# Altium schematic sheet EMG V2.SchDoc
size A4
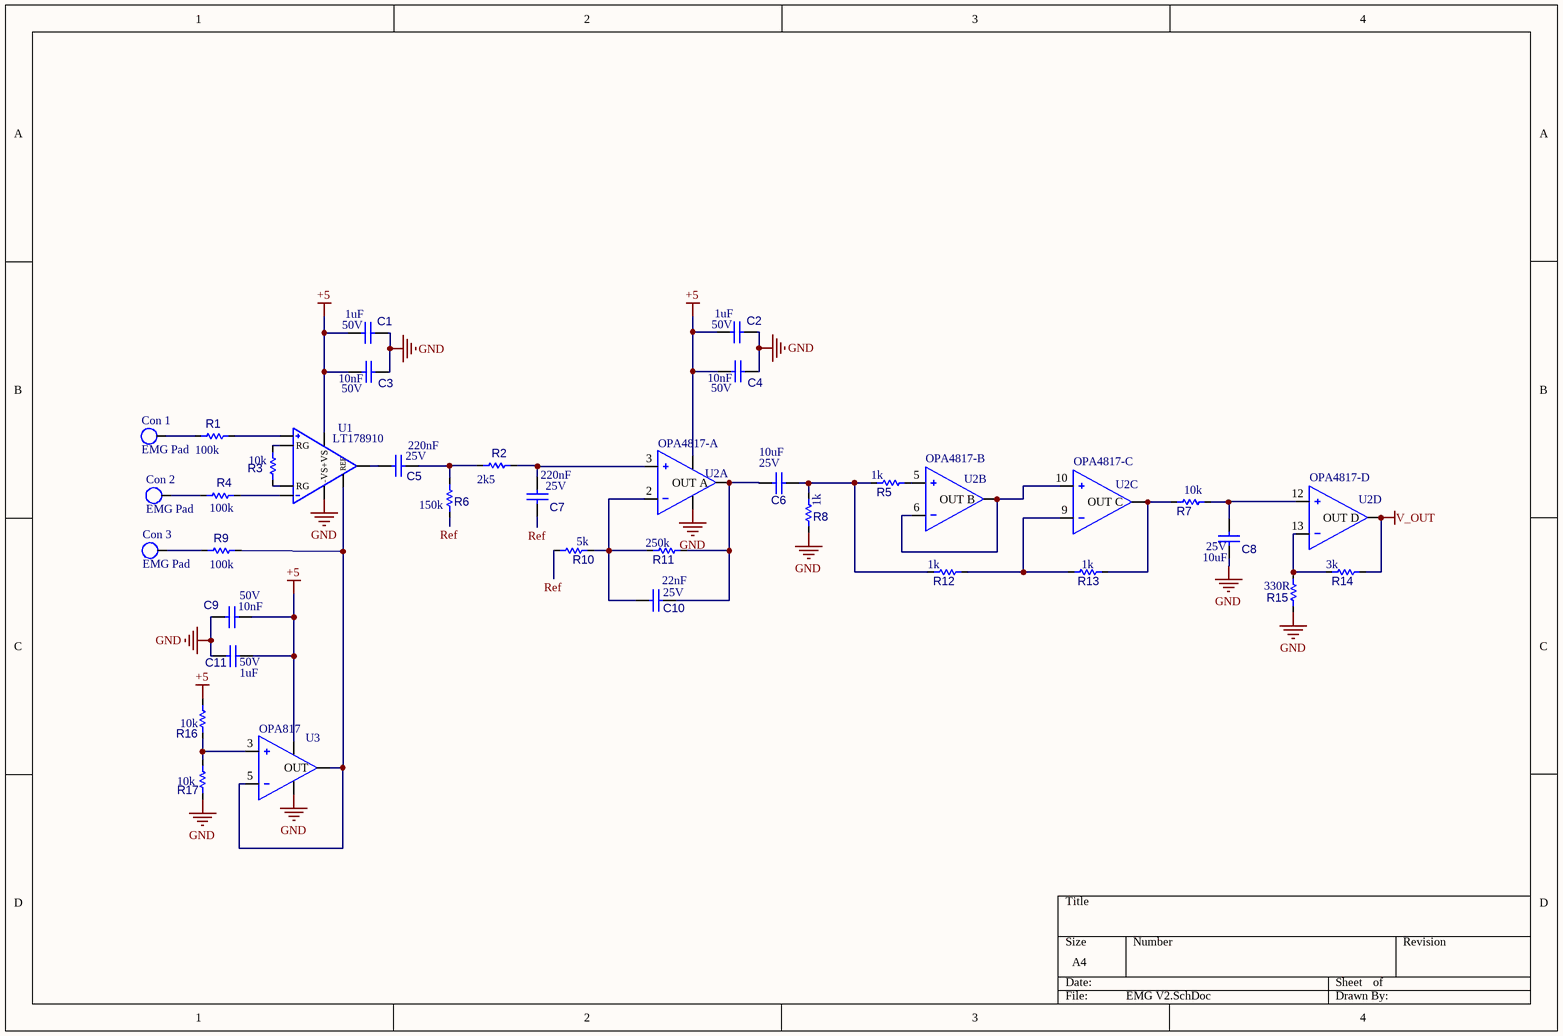
[diagram p0: EMG V2.SchDoc]

## Parts
C1  value 1uF  Voltage: 50V  [0603 Capacitor]  (hidden comment: 1uF/50V)
C2  value 1uF  Voltage: 50V  [0603 Capacitor]  (hidden comment: 1uF/50V)
C3  value 10nF  Voltage: 50V  [0603 Capacitor]  (hidden comment: 10nF/50V)
C4  value 10nF  Voltage: 50V  [0603 Capacitor]  (hidden comment: 10nF/50V)
C5  value 220nF  Voltage: 25V  [0603 Capacitor]  (hidden comment: 220nF/25V)
C6  value 10uF  Voltage: 25V  [0603 Capacitor]  (hidden comment: 10uF/25V)
C7  value 220nF  Voltage: 25V  [0603 Capacitor]  (hidden comment: 220nF/25V)
C8  value 10uF  Voltage: 25V  [0603 Capacitor]  (hidden comment: 10uF/25V)
C9  value 10nF  Voltage: 50V  [0603 Capacitor]  (hidden comment: 10nF/50V)
C10  value 22nF  Voltage: 25V  [0603 Capacitor]  (hidden comment: 22nF/25V)
C11  value 1uF  Voltage: 50V  [0603 Capacitor]  (hidden comment: 1uF/50V)
Con_1  EMG Pad  [PCBComponent_1]
Con_2  EMG Pad  [PCBComponent_1]
Con_3  EMG Pad  [PCBComponent_1]
R1  100k  [0603 Resistor]
R2  2k5  [0603 Resistor]
R3  10k  [0603 Resistor]
R4  100k  [0603 Resistor]
R5  1k  [0603 Resistor]
R6  150k  [0603 Resistor]
R7  10k  [0603 Resistor]
R8  1k  [0603 Resistor]
R9  100k  [0603 Resistor]
R10  5k  [0603 Resistor]
R11  250k  [0603 Resistor]
R12  1k  [0603 Resistor]
R13  1k  [0603 Resistor]
R14  3k  [0603 Resistor]
R15  330R  [0603 Resistor]
R16  10k  [0603 Resistor]
R17  10k  [0603 Resistor]
U1  LT178910  [SOIC 8 LT178910]
U2  OPA4817  [TSSOP14 OPA4187]  (value not drawn)  (parts A,B,C,D of 4)
U3  OPA187  [SOT23-5]  (value not drawn)

## Nets
+5: C1.1 C2.1 C3.1 C4.1 C9.1 C11.1 R16.1 U1.7(+VS) U2.4(V+) U3.4(V+)
GND: C1.2 C2.2 C3.2 C4.2 C8.2 C9.2 C11.2 R8.2 R15.2 R17.2 U1.4(-VS) U2.11(V-) U3.2(V-)
V_OUT: R14.2 U2.14(OUT_D)
Ref: C7.2 R6.2 R10.1
NetC5_1: C5.1 U1.6(OUT)
NetC5_2: C5.2 R2.1 R6.1
NetC6_1: C6.1 C10.2 R11.2 U2.1(OUT_A)
NetC6_2: C6.2 R5.1 R8.1 R12.1
NetC7_1: C7.1 R2.2 U2.3(+IN_A)
NetC8_1: C8.1 R7.2 U2.12(+IN_C)
NetC10_1: C10.1 R10.2 R11.1 U2.2(-IN_A)
NetCon_1_1: Con_1.1 R1.1
NetCon_2_1: Con_2.1 R4.1
NetCon_3_1: Con_3.1 R9.1
NetR1_2: R1.2 U1.3(+IN)
NetR3_1: R3.1 U1.1(RG)
NetR3_2: R3.2 U1.8(RG)
NetR4_2: R4.2 U1.2(-IN)
NetR5_2: R5.2 U2.5(+IN_B)
NetR7_1: R7.1 R13.2 U2.8(OUT_C)
NetR9_2: R9.2 U1.5(REF) U3.1(OUT) U3.5(-IN)
NetR12_2: R12.2 R13.1 U2.9(-IN_C)
NetR14_1: R14.1 R15.1 U2.13(-IN_C)
NetR16_2: R16.2 R17.1 U3.3(+IN)
NetU2_6: U2.6(-IN_B) U2.7(OUT_B) U2.10(+IN_C)

## Notes on the sheet
- (in symbol OPA187-2) OPA817
- (in symbol OPA4817-2, part A) OPA4817-A
- (in symbol OPA4817-2, part B) OPA4817-B
- (in symbol OPA4817-2, part C) OPA4817-C
- (in symbol OPA4817-2, part D) OPA4817-D

## Library data of the parts
C1 C2 C11 = 1uF/50V: Manufacturer: Any; Tolerance: 20%; Capacitor Type: Ceramic; Dielectryc: X7R; Temperature: -55ºC TO +125ºC; Mount Type: SMD; Manufacturer PN: Any; Package: 0603
C3 C4 C9 = 10nF/50V: Manufacturer: Any; Tolerance: 20%; Capacitor Type: Ceramic; Dielectryc: X7R; Temperature: -55ºC TO +125ºC; Mount Type: SMD; Manufacturer PN: Any; Package: 0603
C5 C7 = 220nF/25V: Manufacturer: Any; Tolerance: 20%; Capacitor Type: Ceramic; Dielectryc: X7R; Temperature: -55ºC TO +125ºC; Mount Type: SMD; Manufacturer PN: Any; Package: 0603
C6 C8 = 10uF/25V: Manufacturer: Any; Tolerance: 20%; Capacitor Type: Ceramic; Dielectryc: X7R; Temperature: -55ºC TO +125ºC; Mount Type: SMD; Manufacturer PN: Any; Package: 0603
C10 = 22nF/25V: Manufacturer: Any; Tolerance: 20%; Capacitor Type: Ceramic; Dielectryc: X7R; Temperature: -55ºC TO +125ºC; Mount Type: SMD; Manufacturer PN: Any; Package: 0603
Con_1-Con_3 = Pad
R1 R4 R9 = 100k: Manufacturer: Any; Tolerance: 10%; Power Dissipation: 1/10 W; Temperature: -55°C to 155°C; Mount Type: SMD; Manufacturer PN: Any; Package: 0603; 150k: 100k
R2 = 2k5: Manufacturer: Any; Tolerance: 10%; Power Dissipation: 1/10 W; Temperature: -55°C to 155°C; Mount Type: SMD; Manufacturer PN: Any; Package: 0603; Value: 2k5
R3 R7 R16 R17 = 10k: Manufacturer: Any; Tolerance: 10%; Power Dissipation: 1/10 W; Temperature: -55ºC TO 155ºC; Mount Type: SMD; Manufacturer PN: Any; Package: 0603; Value: 10k
R5 R8 R12 R13 = 1k: Manufacturer: Any; Tolerance: 10%; Power Dissipation: 1/10 W; Temperature: -55ºC TO 155ºC; Mount Type: SMD; Manufacturer PN: Any; Package: 0603; Value: 1k
R6 = 150k: Manufacturer: Any; Tolerance: 10%; Power Dissipation: 1/10 W; Temperature: -55°C to 155°C; Mount Type: SMD; Manufacturer PN: Any; Package: 0603; 150k: 150k
R10 = 5k: Manufacturer: Any; Tolerance: 10%; Power Dissipation: 1/10 W; Temperature: -55ºC TO 155ºC; Mount Type: SMD; Manufacturer PN: Any; Package: 0603; Value: 5k
R11 = 250k: Manufacturer: Any; Tolerance: 10%; Power Dissipation: 1/10 W; Temperature: -55ºC TO 155ºC; Mount Type: SMD; Manufacturer PN: Any; Package: 0603; Value: 250k
R14 = 3k: Manufacturer: Any; Tolerance: 10%; Power Dissipation: 1/10 W; Temperature: -55ºC TO 155ºC; Mount Type: SMD; Manufacturer PN: Any; Package: 0603; Value: 3k
R15 = 330R: Manufacturer: Any; Tolerance: 10%; Power Dissipation: 1/10 W; Temperature: -55ºC TO 155ºC; Mount Type: SMD; Manufacturer PN: Any; Package: 0603; Value: 330R
U1 = LT178910-2: Micropower, Single Supply Rail-to-Rail, Output Instrumentation Amplifiers; Manufacturer: Linear Technologiy; IC Type: INA; Voltage Range: -36V to 36 V; Output Current: 1mA; Package: SOIC 8; Mount Type: SMD
U2 = OPA4817-2: OPAx187, Low Power, Rail-to-Rail Output,36-V Operational Amplifiers; Manufacturer: TEXAS INSTRUMENTS; IC Type: OPAMP; Voltage Range: 2.25V to 18V; Output Current: 20 mA; Package: TSSOP14; Mount Type: SMD
U3 = OPA187-2: OPAx187, Low Power, Rail-to-Rail Output,36-V Operational Amplifiers; Manufacturer: TEXAS INSTRUMENTS; IC Type: OPAMP; Voltage Range: 2.25V to 18V; Output Current: 20 mA; Package: SOT 23-5; Mount Type: SMD; Manufacturer PN: OPA187